# Altium schematic sheet MCU.SchDoc
size D
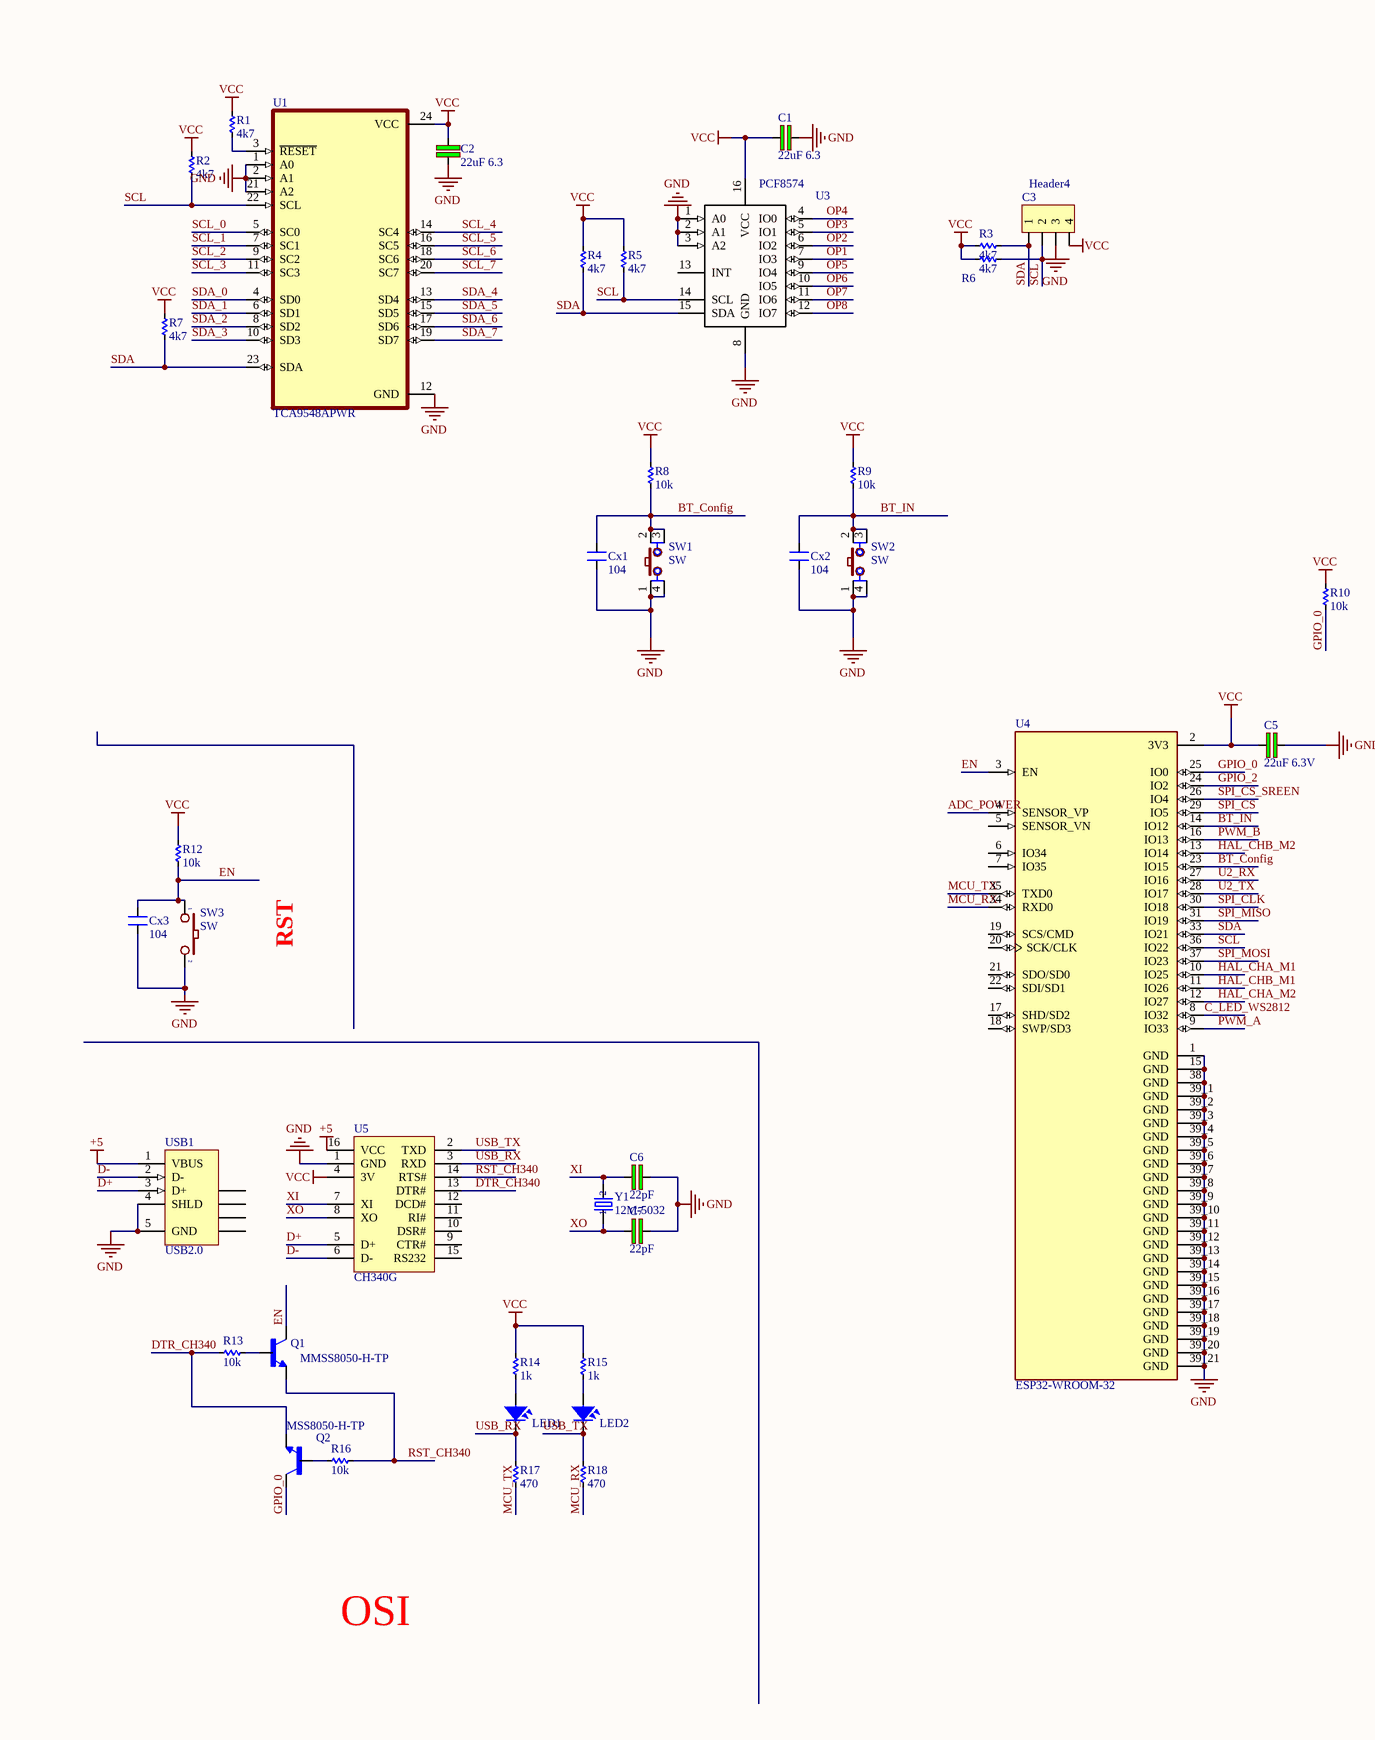
[diagram p0: MCU.SchDoc, left]
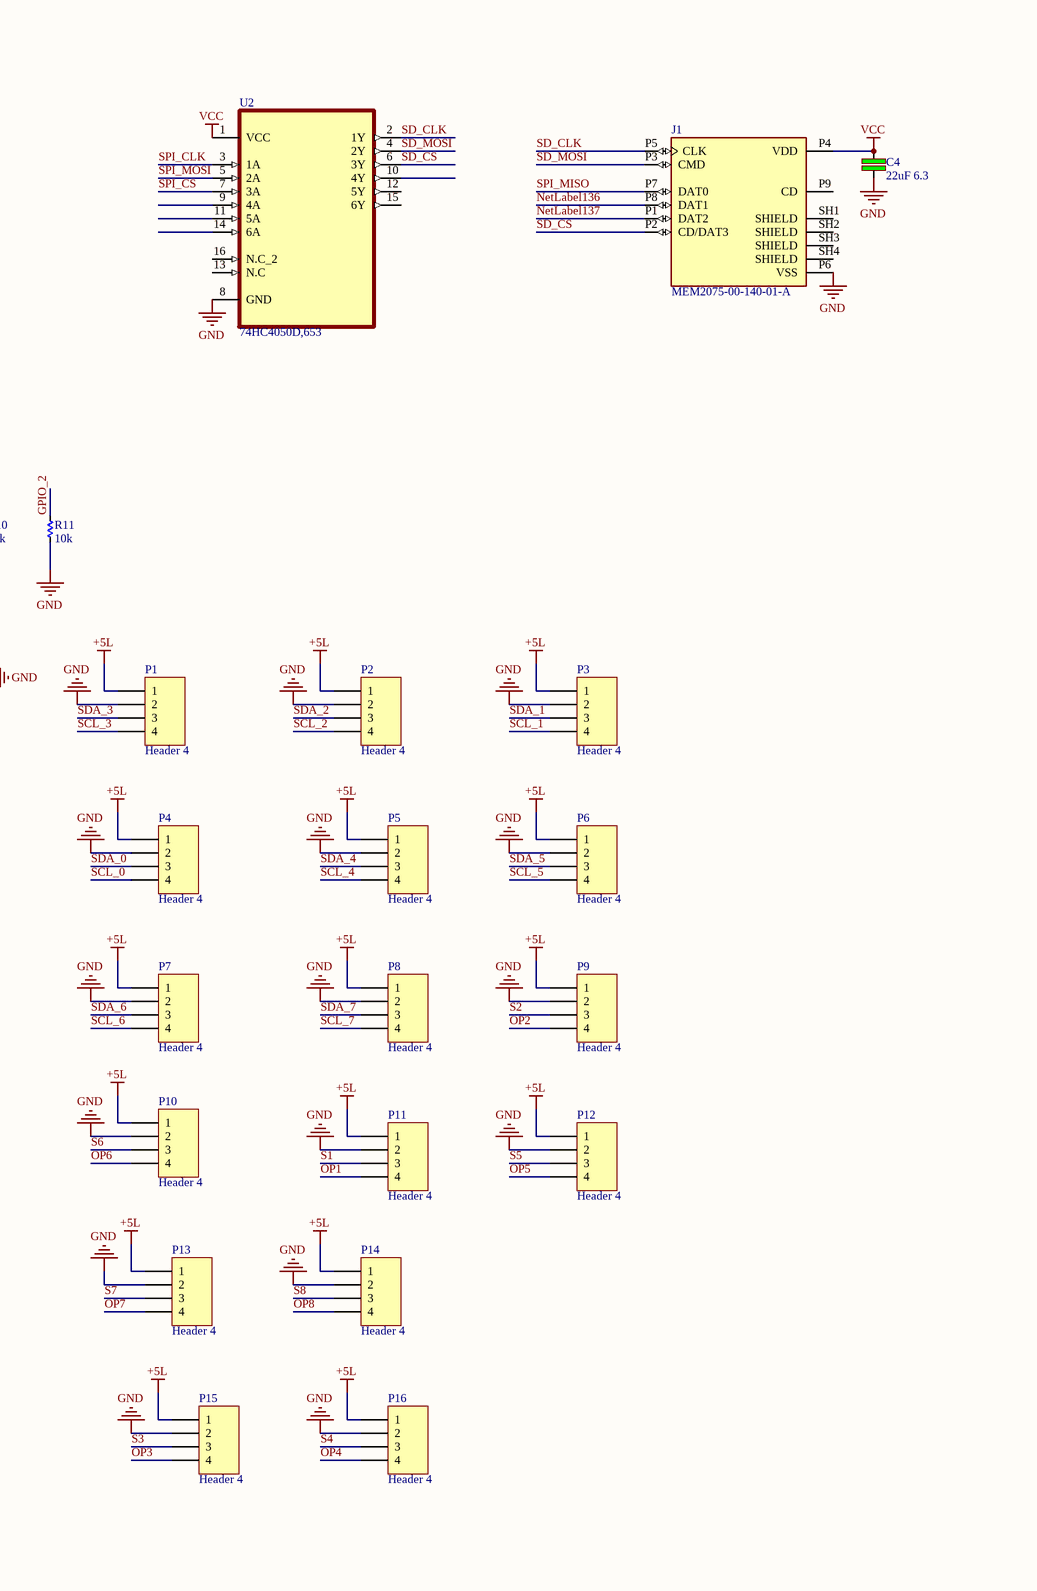
[diagram p1: MCU.SchDoc, right]

## Parts
C1  22uF 6.3  [CN-SMD-1206]
C2  22uF 6.3  [CN-SMD-1206]
C3  Header4  [JP4-C1T]
C4  22uF 6.3  [CN-SMD-1206]
C5  22uF 6.3V  [CN-SMD-1206]
C6  22pF  [CN-SMD-0603]
C7  22pF  [CN-SMD-0603]
Cx1  104  [CN-SMD-0603]
Cx2  104  [CN-SMD-0603]
Cx3  104  [CN-SMD-0603]
J1  MEM2075-00-140-01-A  [GCT_MEM2075-00-140-01-A]
LED1  LED  [LED-0805-Blue]  (value not drawn)
LED2  LED  [LED-0805-Blue]  (value not drawn)
P1  Header 4  [Header_4_ngang]
P2  Header 4  [Header_4_ngang]
P3  Header 4  [Header_4_ngang]
P4  Header 4  [Header_4_ngang]
P5  Header 4  [Header_4_ngang]
P6  Header 4  [Header_4_ngang]
P7  Header 4  [Header_4_ngang]
P8  Header 4  [Header_4_ngang]
P9  Header 4  [Header_4_ngang]
P10  Header 4  [Header_4_ngang]
P11  Header 4  [Header_4_ngang]
P12  Header 4  [Header_4_ngang]
P13  Header 4  [Header_4_ngang]
P14  Header 4  [Header_4_ngang]
P15  Header 4  [Header_4_ngang]
P16  Header 4  [Header_4_ngang]
Q1  MMSS8050-H-TP  [TRANS_MMSS8050-H-TP]
Q2  MSS8050-H-TP  [TRANS_MMSS8050-H-TP]
R1  4k7  [RES-SMD-0603]
R2  4k7  [RES-SMD-0603]
R3  4k7  [RES-SMD-0603]
R4  4k7  [RES-SMD-0603]
R5  4k7  [RES-SMD-0603]
R6  4k7  [RES-SMD-0603]
R7  4k7  [RES-SMD-0603]
R8  10k  [RES-SMD-0603]
R9  10k  [RES-SMD-0603]
R10  10k  [RES-SMD-0603]
R11  10k  [RES-SMD-0603]
R12  10k  [RES-SMD-0603]
R13  10k  [RES-SMD-0603]
R14  1k  [RES-SMD-0603]
R15  1k  [RES-SMD-0603]
R16  10k  [RES-SMD-0603]
R17  470  [RES-SMD-0603]
R18  470  [RES-SMD-0603]
SW1  SW  [SW2-SMD]
SW2  SW  [SW2-SMD]
SW3  SW  [SW1-SMD]
U1  TCA9548APWR  [SOP65P640X120-24N]
U2  74HC4050D,653  [SOIC127P600X175-16N]
U3  PCF8574  [SO16L]
U4  ESP32-WROOM-32  [MODULE_ESP32-WROOM-32]
U5  CH340G  [SO16]
USB1  USB2.0  [USB mini]
Y1  12M-5032  [X2-SMD-5.0X3.2X1.3MM]

## Nets
+5: U5.16(VCC) USB1.1(VBUS)
+5L: P1.1 P2.1 P3.1 P4.1 P5.1 P6.1 P7.1 P8.1 P9.1 P10.1 P11.1 P12.1 P13.1 P14.1 P15.1 P16.1
GND: C1.1 C2.1 C3.3 C4.1 C5.1 C6.2 C7.2 Cx1.1 Cx2.1 Cx3.1 J1.P6(VSS) P1.2 P2.2 P3.2 P4.2 P5.2 P6.2 P7.2 P8.2 P9.2 P10.2 P11.2 P12.2 P13.2 P14.2 P15.2 P16.2 R11.1 SW1.1 SW1.4 SW2.1 SW2.4 SW3.2 U1.1(A0) U1.2(A1) U1.12(GND) U1.21(A2) U2.8(GND) U3.1(A0) U3.2(A1) U3.3(A2) U3.8(GND) U4.1(GND) U4.15(GND) U4.38(GND) U4.39_1(GND) U4.39_2(GND) U4.39_3(GND) U4.39_4(GND) U4.39_5(GND) U4.39_6(GND) U4.39_7(GND) U4.39_8(GND) U4.39_9(GND) U4.39_10(GND) U4.39_11(GND) U4.39_12(GND) U4.39_13(GND) U4.39_14(GND) U4.39_15(GND) U4.39_16(GND) U4.39_17(GND) U4.39_18(GND) U4.39_19(GND) U4.39_20(GND) U4.39_21(GND) U5.1(GND) USB1.4(SHLD) USB1.5(GND)
VCC: C1.2 C2.2 C3.4 C4.2 C5.2 J1.P4(VDD) R1.2 R2.2 R3.2 R4.2 R5.2 R6.2 R7.2 R8.2 R9.2 R10.2 R12.2 R14.2 R15.2 U1.24(VCC) U2.1(VCC) U3.16(VCC) U4.2(3V3) U5.4(3V)
ADC_POWER: U4.4(SENSOR_VP)
BT_Config: Cx1.2 R8.1 SW1.2 SW1.3 U4.23(IO15)
BT_IN: Cx2.2 R9.1 SW2.2 SW2.3 U4.14(IO12)
C_LED_WS2812: U4.8(IO32)
D+: U5.5(D+) USB1.3(D+)
D-: U5.6(D-) USB1.2(D-)
DTR_CH340: Q2.2(E) R13.1 U5.13(DTR#)
EN: Cx3.2 Q1.3(C) R12.1 SW3.1 U4.3(EN)
GPIO_0: Q2.3(C) R10.1 U4.25(IO0)
GPIO_2: R11.2 U4.24(IO2)
HAL_CHA_M1: U4.10(IO25)
HAL_CHA_M2: U4.12(IO27)
HAL_CHB_M1: U4.11(IO26)
HAL_CHB_M2: U4.13(IO14)
MCU_RX: R18.1 U4.34(RXD0)
MCU_TX: R17.1 U4.35(TXD0)
NetLabel136: J1.P8(DAT1)
NetLabel137: J1.P1(DAT2)
OP1: P11.4 U3.7(IO3)
OP2: P9.4 U3.6(IO2)
OP3: P15.4 U3.5(IO1)
OP4: P16.4 U3.4(IO0)
OP5: P12.4 U3.9(IO4)
OP6: P10.4 U3.10(IO5)
OP7: P13.4 U3.11(IO6)
OP8: P14.4 U3.12(IO7)
PWM_A: U4.9(IO33)
PWM_B: U4.16(IO13)
RST_CH340: Q1.2(E) R16.2 U5.14(RTS#)
S1: P11.3
S2: P9.3
S3: P15.3
S4: P16.3
S5: P12.3
S6: P10.3
S7: P13.3
S8: P14.3
SCL: C3.2 R2.1 R5.1 R6.1 U1.22(SCL) U3.14(SCL) U4.36(IO22)
SCL_0: P4.4 U1.5(SC0)
SCL_1: P3.4 U1.7(SC1)
SCL_2: P2.4 U1.9(SC2)
SCL_3: P1.4 U1.11(SC3)
SCL_4: P5.4 U1.14(SC4)
SCL_5: P6.4 U1.16(SC5)
SCL_6: P7.4 U1.18(SC6)
SCL_7: P8.4 U1.20(SC7)
SD_CLK: J1.P5(CLK) U2.2(1Y)
SD_CS: J1.P2(CD/DAT3) U2.6(3Y)
SD_MOSI: J1.P3(CMD) U2.4(2Y)
SDA: C3.1 R3.1 R4.1 R7.1 U1.23(SDA) U3.15(SDA) U4.33(IO21)
SDA_0: P4.3 U1.4(SD0)
SDA_1: P3.3 U1.6(SD1)
SDA_2: P2.3 U1.8(SD2)
SDA_3: P1.3 U1.10(SD3)
SDA_4: P5.3 U1.13(SD4)
SDA_5: P6.3 U1.15(SD5)
SDA_6: P7.3 U1.17(SD6)
SDA_7: P8.3 U1.19(SD7)
SPI_CLK: U2.3(1A) U4.30(IO18)
SPI_CS: U2.7(3A) U4.29(IO5)
SPI_CS_SREEN: U4.26(IO4)
SPI_MISO: J1.P7(DAT0) U4.31(IO19)
SPI_MOSI: U2.5(2A) U4.37(IO23)
U2_RX: U4.27(IO16)
U2_TX: U4.28(IO17)
USB_RX: LED1.2 R17.2 U5.3(RXD)
USB_TX: LED2.2 R18.2 U5.2(TXD)
XI: C6.1 U5.7(XI) Y1.2
XO: C7.1 U5.8(XO) Y1.1
NetLED1_1: LED1.1 R14.1
NetLED2_1: LED2.1 R15.1
NetQ1_1: Q1.1(B) R13.2
NetQ2_1: Q2.1(B) R16.1
NetR1_1: R1.1 U1.3(~{RESET})

Not connected (* = marked no-connect by the designer): J1 P9(CD) SH1(SHIELD) SH2(SHIELD) SH3(SHIELD) SH4(SHIELD); U2 9(4A) 10(4Y) 11(5A) 12(5Y) 13(N.C) 14(6A) 15(6Y) 16(N.C_2); U3 13(INT); U4 5(SENSOR_VN) 6(IO34) 7(IO35) 17(SHD/SD2) 18(SWP/SD3) 19(SCS/CMD) 20(SCK/CLK) 21(SDO/SD0) 22(SDI/SD1); U5 9(CTR#) 10(DSR#) 11(RI#) 12(DCD#) 15(RS232); USB1 6(SHLD) 7(SHLD) 8(SHLD) 9(SHLD)

## Layout directives
net class MCU: +5, +5L, ADC_POWER, BT_Config, BT_IN, C_LED_WS2812, D+, D-, DTR_CH340, EN, GND, GPIO_0, GPIO_2, HAL_CHA_M1, HAL_CHA_M2, HAL_CHB_M1, HAL_CHB_M2, MCU_RX, MCU_TX, NetLabel136, NetLabel137, OP1, OP2, OP3, OP4, OP5, OP6, OP7, OP8, PWM_A, PWM_B, RST_CH340, S1, S2, S3, S4, S5, S6, S7, S8, SCL, SCL_0, SCL_1, SCL_2, SCL_3, SCL_4, SCL_5, SCL_6, SCL_7, SD_CLK, SD_CS, SD_MOSI, SDA, SDA_0, SDA_1, SDA_2, SDA_3, SDA_4, SDA_5, SDA_6, SDA_7, SPI_CLK, SPI_CS, SPI_CS_SREEN, SPI_MISO, SPI_MOSI, U2_RX, U2_TX, USB_RX, USB_TX, VCC, XI, XO

## Notes on the sheet
- RST
- OSI

## Library data of the parts
C1 C2 C4 C5 = C: Cap SMD 1206 >5V; Value: 103
C3 = Header4: Header IDC, 4 x 1 Pin Vertical 2.54mm Pitch (Non-Boxed, Male); Manufacturer: W¨¹rth Elektronik eiSos GmbH; partNo: 613002143121; ComponentLink1 Description: Manufacturer; ComponentLink2 Description: Datasheet; NoPins: 02; Created Date: 29 March 2013; ComponentLink1URL: http://www.we-online.com; ComponentLink2URL: http://katalog.we-online.de/em/datasheet/6130xx143121.pdf; Created by: Karrer Zheng
C6 C7 = C: Cap SMD; Value: 103
Cx1-Cx3 = CN: Value: 33pF
J1 = MEM2075-00-140-01-A: 9 _8 + 1_ Position Card Connector microSDâ„¢ Surface Mount, Right Angle Gold; MF: Global Connector Technology; Availability: Unavailable; Price: None; SnapEDA_Link: https://www.snapeda.com/parts/MEM2075-00-140-01-A/Global%20Connector%20Technology/view-part/2680480/?ref=snap; Value: *; Package: Package Analog Devices; MP: MEM2075-00-140-01-A
LED1 LED2 = LED SMD: Value: LED 3 - 5 ly 2 Colour
P1-P16 = Header 4: Header, 4-Pin; LatestRevisionDate: 17-Jul-2002; LatestRevisionNote: Re-released for DXP Platform.; Publisher: Altium Limited
Q1 Q2 = MMSS8050-H-TP: Bipolar _BJT_ Transistor NPN 25V 1.5A 100MHz 625mW Surface Mount SOT-23; MF: Micro Commercial; Value: *; Availability: Unavailable; SnapEDA_Link: https://www.snapeda.com/parts/MMSS8050-H-TP/Micro%20Commercial/view-part/423878/?ref=snap; Package: SOT-23 Micro Commercial; MP: MMSS8050-H-TP; Price: None
R1-R18 = Res-SMD: Resistor; Manufacturer: Generic Components; Class: Passive; Published: 08/06/2000; Publisher: Altium Hobart Technology Centre
SW1 SW2 = SW4: Switch button 4 pin; Value: Button chip 4 pin
SW3 = SW2: Switch button 2 pin; Value: SW chip 2 pin
U1 = TCA9548APWR: Low-Voltage 8-Channel I2C Switch With Reset; MF: Texas Instruments; MP: TCA9548APWR; Price: None; DigiKey-Purchase-URL: https://snapeda.com/shop?store=DigiKey&id=280817; Package: TSSOP-24 Texas Instruments; Mouser-Purchase-URL: https://snapeda.com/shop?store=Mouser&id=280817; Texas_Instruments-Purchase-URL: https://snapeda.com/shop?store=Texas+Instruments&id=280817; Value: *; Availability: Unavailable; Arrow_Electronics-Purchase-URL: https://snapeda.com/shop?store=Arrow+Electronics&id=280817; SnapEDA_Link: https://www.snapeda.com/parts/TCA9548APWR/Texas%20Instruments/view-part/280817/?ref=snap
U2 = 74HC4050D,653: Buffer, Non-Inverting 6 Element 1 Bit per Element Push-Pull Output 16-SO; MF: Nexperia USA; Value: *; SnapEDA_Link: https://www.snapeda.com/parts/74HC4050D%2C653/Nexperia%20USA%20Inc./view-part/1791461/?ref=snap; Digi-Key_Purchase_URL: https://www.digikey.com/product-detail/en/nexperia-usa-inc/74HC4050D,653/1727-6331-1-ND/2762840?utm_source=snapeda&utm_medium=aggregator&utm_campaign=symbol; Package: SO-16 Nexperia; Digi-Key_Part_Number: 1727-6331-1-ND; MP: 74HC4050D,653
U3 = PCF8574: I2C PORT EXPANDER; Manufacturer Part Number: PCF8574T/3,512; Manufacturer: NXP Semiconductors; Includes: POR; Interface: I²C; Interrupt Output: Yes; Number of I /O: 8; Voltage - Supply: 2.5 V ~ 6 V; Frequency - Clock: 100KHz; Supplier 1: Digi-Key; Supplier Part Number 1: 568-1076-5-ND; Package / Case: 16-SOIC (7.5mm Width); Category: Integrated Circuits (ICs); Supplier Part Number: 568-1076-5-ND; Operating Temperature: -40°C ~ 85°C; Packaging: Tube; RoHS: RoHS Compliant; Supplier: Digi-Key
U4 = ESP32-WROOM-32: Bluetooth, WiFi Transceiver Module 2.4GHz ~ 2.5GHz Surface Mount; MF: Espressif Systems; Package: Module Espressif Systems; Digi-Key_Part_Number: 1904-1010-1-ND; Digi-Key_Purchase_URL: https://www.digikey.com/product-detail/en/espressif-systems/ESP32-WROOM-32/1904-1010-1-ND/8544305?utm_source=snapeda&utm_medium=aggregator&utm_campaign=symbol; Value: *; MP: ESP32-WROOM-32; SnapEDA_Link: https://www.snapeda.com/parts/ESP32-WROOM-32/Espressif%20Systems/view-part/2753322/?ref=snap
U5 = CH340G: High and Low Side Driver; Note: Pins 4, 8 and 14 are not connected; Published: 8-Jun-2000; LatestRevisionDate: 04-Mar-2005; LatestRevisionNote: Stylized 3D Model Added.; DatasheetVersion: PD60147J; PackageReference: PDIP14; Publisher: Altium Limited; PackageDescription: DIP; 14 Leads; Row Spacing 7.62 mm; Pitch 2.54 mm; ComponentLink1Description: Manufacturer Link; ComponentLink1URL: http://www.irf.com/; ComponentLink2Description: Datasheet; ComponentLink2URL: http://www.irf.com/product-info/datasheets/data/ir2110.pdf
USB1 = USB: USB 2.0, Right Angle, SMT, B Type, Receptacle, 5 Position, Black; ContactMaterial: Copper Alloy; ContactPlating: Gold (30); PCB_Layout: Complies with manufacturer's recommendation.; DrillSize: Corresponds to nominal value.; PanelGround: Without; Published: 15-Jul-2004; DatasheetDocument: 27-Jun-2003; PackageDocument: 27-Jun-2003; PackageReference: 440247; Publisher: Altium Limited; HousingMaterial: Thermoplastic; ComponentLink1Description: Manufacturer Link; ComponentLink1URL: http://www.tycoelectronics.com/; ComponentLink2Description: Packaging Specification; ComponentLink2URL: http://ecommas.tycoelectronics.com/commerce/DocumentDelivery/DDEController?Action=showdoc&DocId=Customer+Drawing%7F440247%7FD%7Fpdf%7FEnglish%7FC_440247_D.pdf
Y1 = SMD-CRYSTAL-8MHZ-20PF-20PPM(2P-5.0X3.2MM): SMD Crystal 8MHz-20pF-20ppm;; MF: Xinhunjing; MP: 5032/4P; Price: None; Availability: Unavailable; Package: None; SnapEDA_Link: https://www.snapeda.com/parts/5032/4P/Xinhunjing/view-part/105660/?ref=snap; Value: *